# Altium schematic sheet Communication.SchDoc: Communication
size B; SheetNumber: 4; SheetTotal: 13; Competition: SAC 2021; Subteam: Avionics; University: McGill University; Location: Montreal, Quebec; Project: Avionics Project Name; MRT: McGill Rocket Team
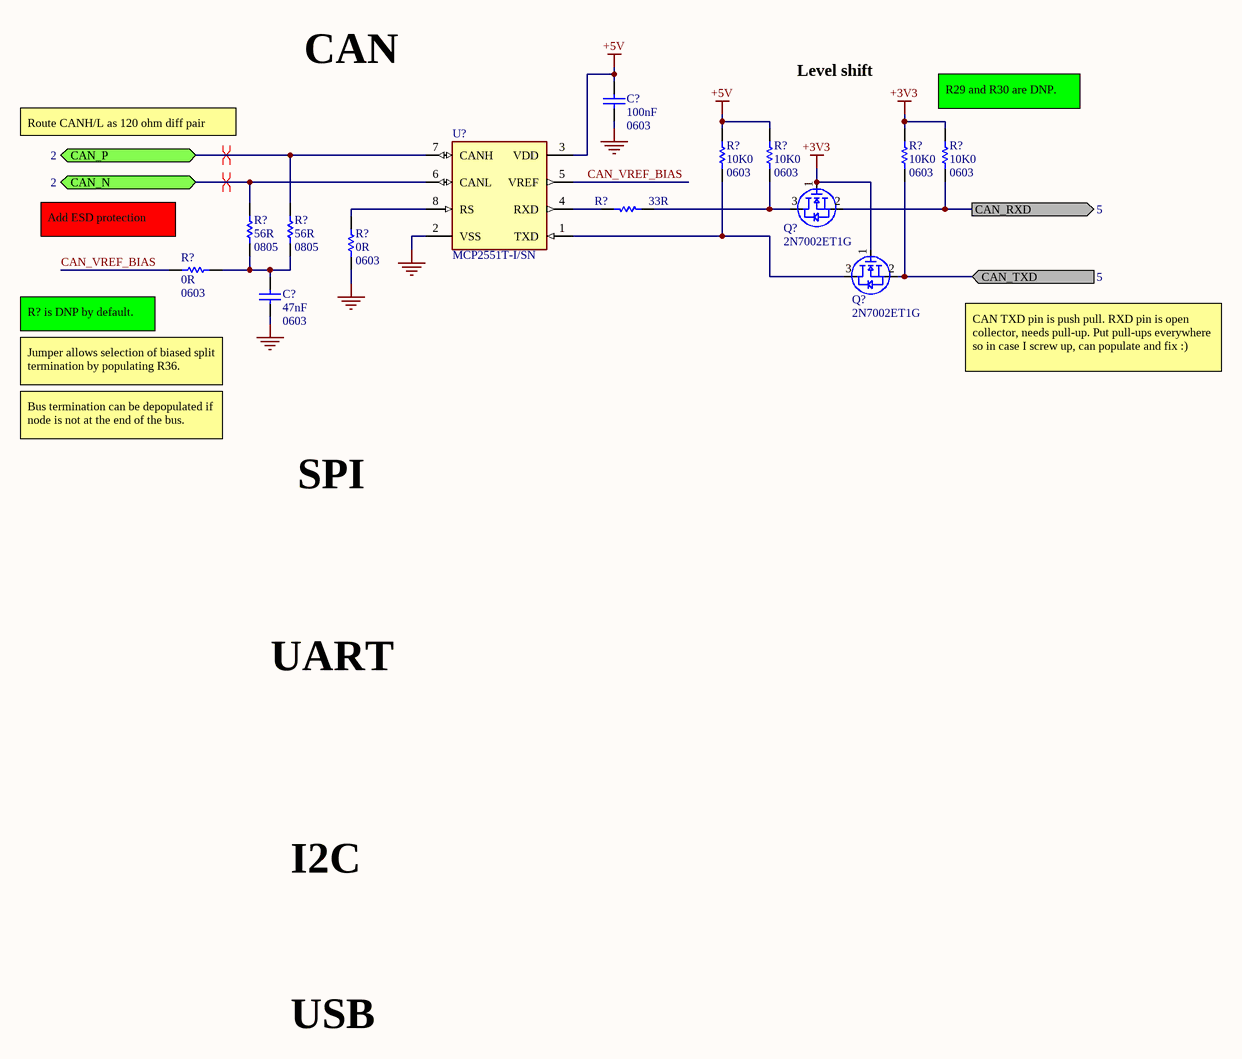
[diagram p0: Communication.SchDoc]

## Parts
(Parts that share a designator on the sheet are numbered #1, #2 ... from top to bottom, then left to right.)
C?#1  100nF  value 0603  [0603 CAP SAMSUNG CL10C]
C?#2  47nF  value 0603  [0603 CAP SAMSUNG CL10C]
Q?#1  2N7002ET1G  [SOT23-3]
Q?#2  2N7002ET1G  [SOT23-3]
R?#1  10K0  value 0603  [0603 RES]
R?#2  10K0  value 0603  [0603 RES]
R?#3  10K0  value 0603  [0603 RES]
R?#4  10K0  value 0603  [0603 RES]
R?#5  33R  [0603 RES]
R?#6  56R  value 0805  [0805 RES]
R?#7  56R  value 0805  [0805 RES]
R?#8  0R  value 0603  [0603 RES]
R?#9  0R  value 0603  [0603 RES]
U?  MCP2551T-I/SN  [FP-C04-057-SN-IPC_B]

## Ports
CAN_N (bidir, see 2), CAN_P (bidir, see 2), CAN_RXD (out, see 5), CAN_TXD (in, see 5)

## Nets
+3V3: Q?#1.1(Gate) Q?#2.1(Gate) R?#3.2 R?#4.2
+5V: C?#1.2 R?#1.2 R?#2.2 U?.3(VDD)
GND: C?#1.1 C?#2.1 R?#8.1 U?.2(VSS)
CAN_N: R?#6.2 U?.6(CANL) ; port CAN_N
CAN_P: R?#7.2 U?.7(CANH) ; port CAN_P
CAN_RXD: Q?#1.2(Source) R?#4.1 ; port CAN_RXD
CAN_TXD: Q?#2.2(Source) R?#3.1 ; port CAN_TXD
CAN_VREF_BIAS: R?#9.2 U?.5(VREF)
NetC?#2_2: C?#2.2 R?#6.1 R?#7.1 R?#9.1
NetQ?#1_3: Q?#1.3(Drain) R?#2.1 R?#5.1
NetQ?#2_3: Q?#2.3(Drain) R?#1.1 U?.1(TXD)
NetR?#5_2: R?#5.2 U?.4(RXD)
NetR?#8_2: R?#8.2 U?.8(RS)

## Layout directives
differential pair: CAN_N, CAN_P

## Notes on the sheet
- CAN
- Level shift
- (near R?#4) R29 and R30 are DNP.
- Route CANH/L as 120 ohm diff pair
- (near R?#9) Add ESD protection
- (near R?#9) R? is DNP by default.
- Jumper allows selection of biased split termination by populating R36.
- CAN TXD pin is push pull. RXD pin is open collector, needs pull-up. Put pull-ups everywhere so in case I screw up, can populate and fix :)
- Bus termination can be depopulated if node is not at the end of the bus.
- SPI
- UART
- I2C
- USB
- Title
- Size:
- Date:
- B
- Revision:
- Time:
- Drawn By:
- Sheet
- of
- File:

## Library data of the parts
C?#1 C?#2 = Cap: Capacitor; Published: 8-Jun-2000; LatestRevisionDate: 17-Jul-2002; LatestRevisionNote: Re-released for DXP Platform.; PackageReference: RAD-0.3; Publisher: Altium Limited; PackageDescription: Radial Cap, Thru-Hole; 2 Leads; 0.3 in Pin Spacing
Q?#1 Q?#2 = NMOS: Generic N-channel MOSFET
R?#1-R?#4 R?#6-R?#9 = Res1: Resistor; Published: 8-Jun-2000; LatestRevisionDate: 17-Jul-2002; LatestRevisionNote: Re-released for DXP Platform.; PackageReference: AXIAL-0.3; Publisher: Altium Limited; PackageDescription: Axial Device, Thru-Hole; 2 Leads; 0.3 in Pin Spacing
R?#5 = Res1: RC0603FR-0733RL / 0603 / in stock; Value: 1K; Published: 8-Jun-2000; LatestRevisionDate: 17-Jul-2002; LatestRevisionNote: Re-released for DXP Platform.; PackageReference: AXIAL-0.3; Publisher: Altium Limited; PackageDescription: Axial Device, Thru-Hole; 2 Leads; 0.3 in Pin Spacing
U? = CMP-0186-00037-3: IC TRANSCEIVER HALF 1/1 8SOIC; Interface: CAN; Nominal Supply Current: 75mA; Number of Receive Buffers: 1; Operating Supply Voltage: 5V; Data Rate: 1Mbps; Max Supply Voltage: 5.5V; Min Supply Voltage: 4.5V; Package Quantity: 3300; Packaging: Tape and Reel; REACH SVHC: No SVHC; Radiation Hardening: No; Case/Package: SOIC; Max Supply Current: 75mA; Lead Free: Lead Free; Number of Transmit Buffers: 1; Length: 4.9mm; Number of Transceivers: 1; Min Operating Temperature: -40°C; Number of Pins: 8; Height: 1.5mm; Max Operating Temperature: 85°C; Number of Receivers: 1; Logic Function: Transceiver; Width: 3.9mm; Mount: Surface Mount; Number of Drivers: 1